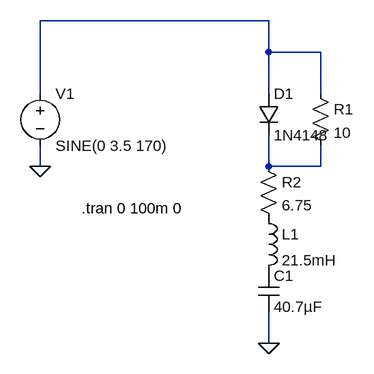
[diagram p0: schematic Offset.asc]
Offset.asc, the LTspice schematic file:
Version 4
SHEET 1 880 680
WIRE 384 0 32 0
WIRE 384 48 384 0
WIRE 464 48 384 48
WIRE 32 112 32 0
WIRE 384 112 384 48
WIRE 464 112 464 48
WIRE 32 224 32 192
WIRE 384 224 384 176
WIRE 464 224 464 192
WIRE 464 224 384 224
WIRE 384 496 384 448
FLAG 32 224 0
FLAG 384 496 0
SYMBOL voltage 32 96 R0
WINDOW 123 0 0 Left 0
WINDOW 39 0 0 Left 0
SYMATTR InstName V1
SYMATTR Value SINE(0 3.5 170)
SYMBOL diode 368 112 R0
SYMATTR InstName D1
SYMATTR Value 1N4148
SYMBOL res 448 96 R0
SYMATTR InstName R1
SYMATTR Value 10
SYMBOL res 368 208 R0
SYMATTR InstName R2
SYMATTR Value 6.75
SYMBOL ind 368 288 R0
SYMATTR InstName L1
SYMATTR Value 21.5mH
SYMBOL cap 368 384 R0
SYMATTR InstName C1
SYMATTR Value 40.7µF
TEXT 96 288 Left 2 !.tran 0 100m 0

The netlist it stands for:
* Offset.asc
V1 N001 0 SINE(0 3.5 170)
D1 N001 N002 1N4148
R1 N001 N002 10
R2 N002 P001 6.75
L1 P001 P002 21.5mH
C1 P002 0 40.7µF
.model D D
.lib standard.dio
.tran 0 100m 0
.backanno
.end